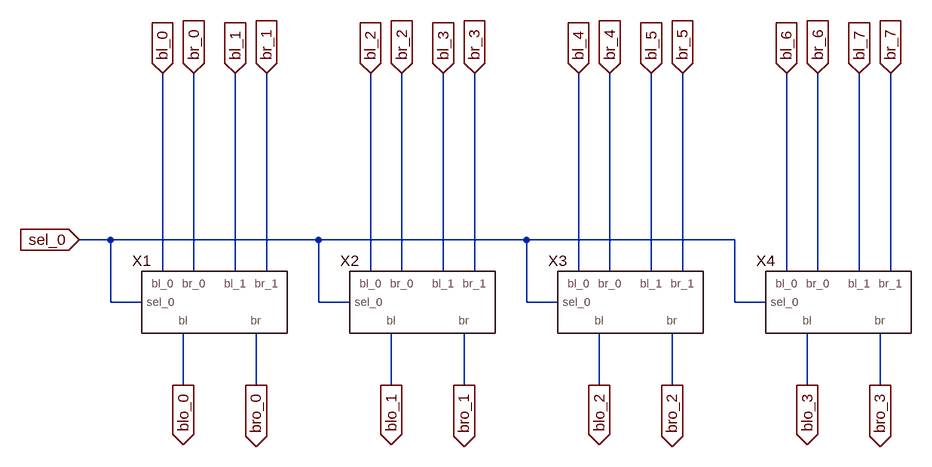
[diagram p0: schematic column_mux.asc]
column_mux.asc, the LTspice schematic file:
Version 4
SHEET 1 1144 680
WIRE 1056 144 1056 -160
WIRE -144 96 -192 96
WIRE 176 96 -144 96
WIRE 496 96 176 96
WIRE 816 96 496 96
WIRE -64 144 -64 -160
WIRE -16 144 -16 -160
WIRE 48 144 48 -160
WIRE 96 144 96 -160
WIRE 256 144 256 -160
WIRE 304 144 304 -160
WIRE 368 144 368 -160
WIRE 416 144 416 -160
WIRE 576 144 576 -160
WIRE 624 144 624 -160
WIRE 688 144 688 -160
WIRE 736 144 736 -160
WIRE 896 144 896 -160
WIRE 944 144 944 -160
WIRE 1008 144 1008 -160
WIRE -144 192 -144 96
WIRE -96 192 -144 192
WIRE 176 192 176 96
WIRE 224 192 176 192
WIRE 496 192 496 96
WIRE 544 192 496 192
WIRE 816 192 816 96
WIRE 864 192 816 192
WIRE -32 320 -32 240
WIRE 80 320 80 240
WIRE 288 320 288 240
WIRE 400 320 400 240
WIRE 608 320 608 240
WIRE 720 320 720 240
WIRE 928 320 928 240
WIRE 1040 320 1040 240
FLAG -64 -160 bl_0
IOPIN -64 -160 In
FLAG 48 -160 bl_1
IOPIN 48 -160 In
FLAG -16 -160 br_0
IOPIN -16 -160 In
FLAG 96 -160 br_1
IOPIN 96 -160 In
FLAG -32 320 blo_0
IOPIN -32 320 Out
FLAG 80 320 bro_0
IOPIN 80 320 Out
FLAG 256 -160 bl_2
IOPIN 256 -160 In
FLAG 368 -160 bl_3
IOPIN 368 -160 In
FLAG 304 -160 br_2
IOPIN 304 -160 In
FLAG 416 -160 br_3
IOPIN 416 -160 In
FLAG 288 320 blo_1
IOPIN 288 320 Out
FLAG 400 320 bro_1
IOPIN 400 320 Out
FLAG 576 -160 bl_4
IOPIN 576 -160 In
FLAG 688 -160 bl_5
IOPIN 688 -160 In
FLAG 624 -160 br_4
IOPIN 624 -160 In
FLAG 736 -160 br_5
IOPIN 736 -160 In
FLAG 608 320 blo_2
IOPIN 608 320 Out
FLAG 720 320 bro_2
IOPIN 720 320 Out
FLAG 896 -160 bl_6
IOPIN 896 -160 In
FLAG 1008 -160 bl_7
IOPIN 1008 -160 In
FLAG 944 -160 br_6
IOPIN 944 -160 In
FLAG 1056 -160 br_7
IOPIN 1056 -160 In
FLAG 928 320 blo_3
IOPIN 928 320 Out
FLAG 1040 320 bro_3
IOPIN 1040 320 Out
FLAG -192 96 sel_0
IOPIN -192 96 In
SYMBOL mux21 16 176 R0
SYMATTR InstName X1
SYMBOL mux21 336 176 R0
SYMATTR InstName X2
SYMBOL mux21 656 176 R0
SYMATTR InstName X3
SYMBOL mux21 976 176 R0
SYMATTR InstName X4

The netlist it stands for:
* column_mux.asc
XX1 bl_0 bl_1 br_0 br_1 sel_0 blo_0 bro_0 mux21  ; pins bl_0 bl_1 br_0 br_1 sel_0 bl br
XX2 bl_2 bl_3 br_2 br_3 sel_0 blo_1 bro_1 mux21  ; pins bl_0 bl_1 br_0 br_1 sel_0 bl br
XX3 bl_4 bl_5 br_4 br_5 sel_0 blo_2 bro_2 mux21  ; pins bl_0 bl_1 br_0 br_1 sel_0 bl br
XX4 bl_6 bl_7 br_6 br_7 sel_0 blo_3 bro_3 mux21  ; pins bl_0 bl_1 br_0 br_1 sel_0 bl br
.backanno
.end